# EasyEDA Pro project EasyEDA_Pro_EXPORT.epro

# Schematic testing_stage1_schematic

## Sheets
1 microcontroller: Board Name: testing_stage1; Create Date: 2025-03-28; Page Name: microcontroller; Project Name: macropad-final; Schematic Name: testing_stage1_schematic; Update Date: 2025-03-29; Company: EasyEDA.com; Page Size: A4; Version: V1.0
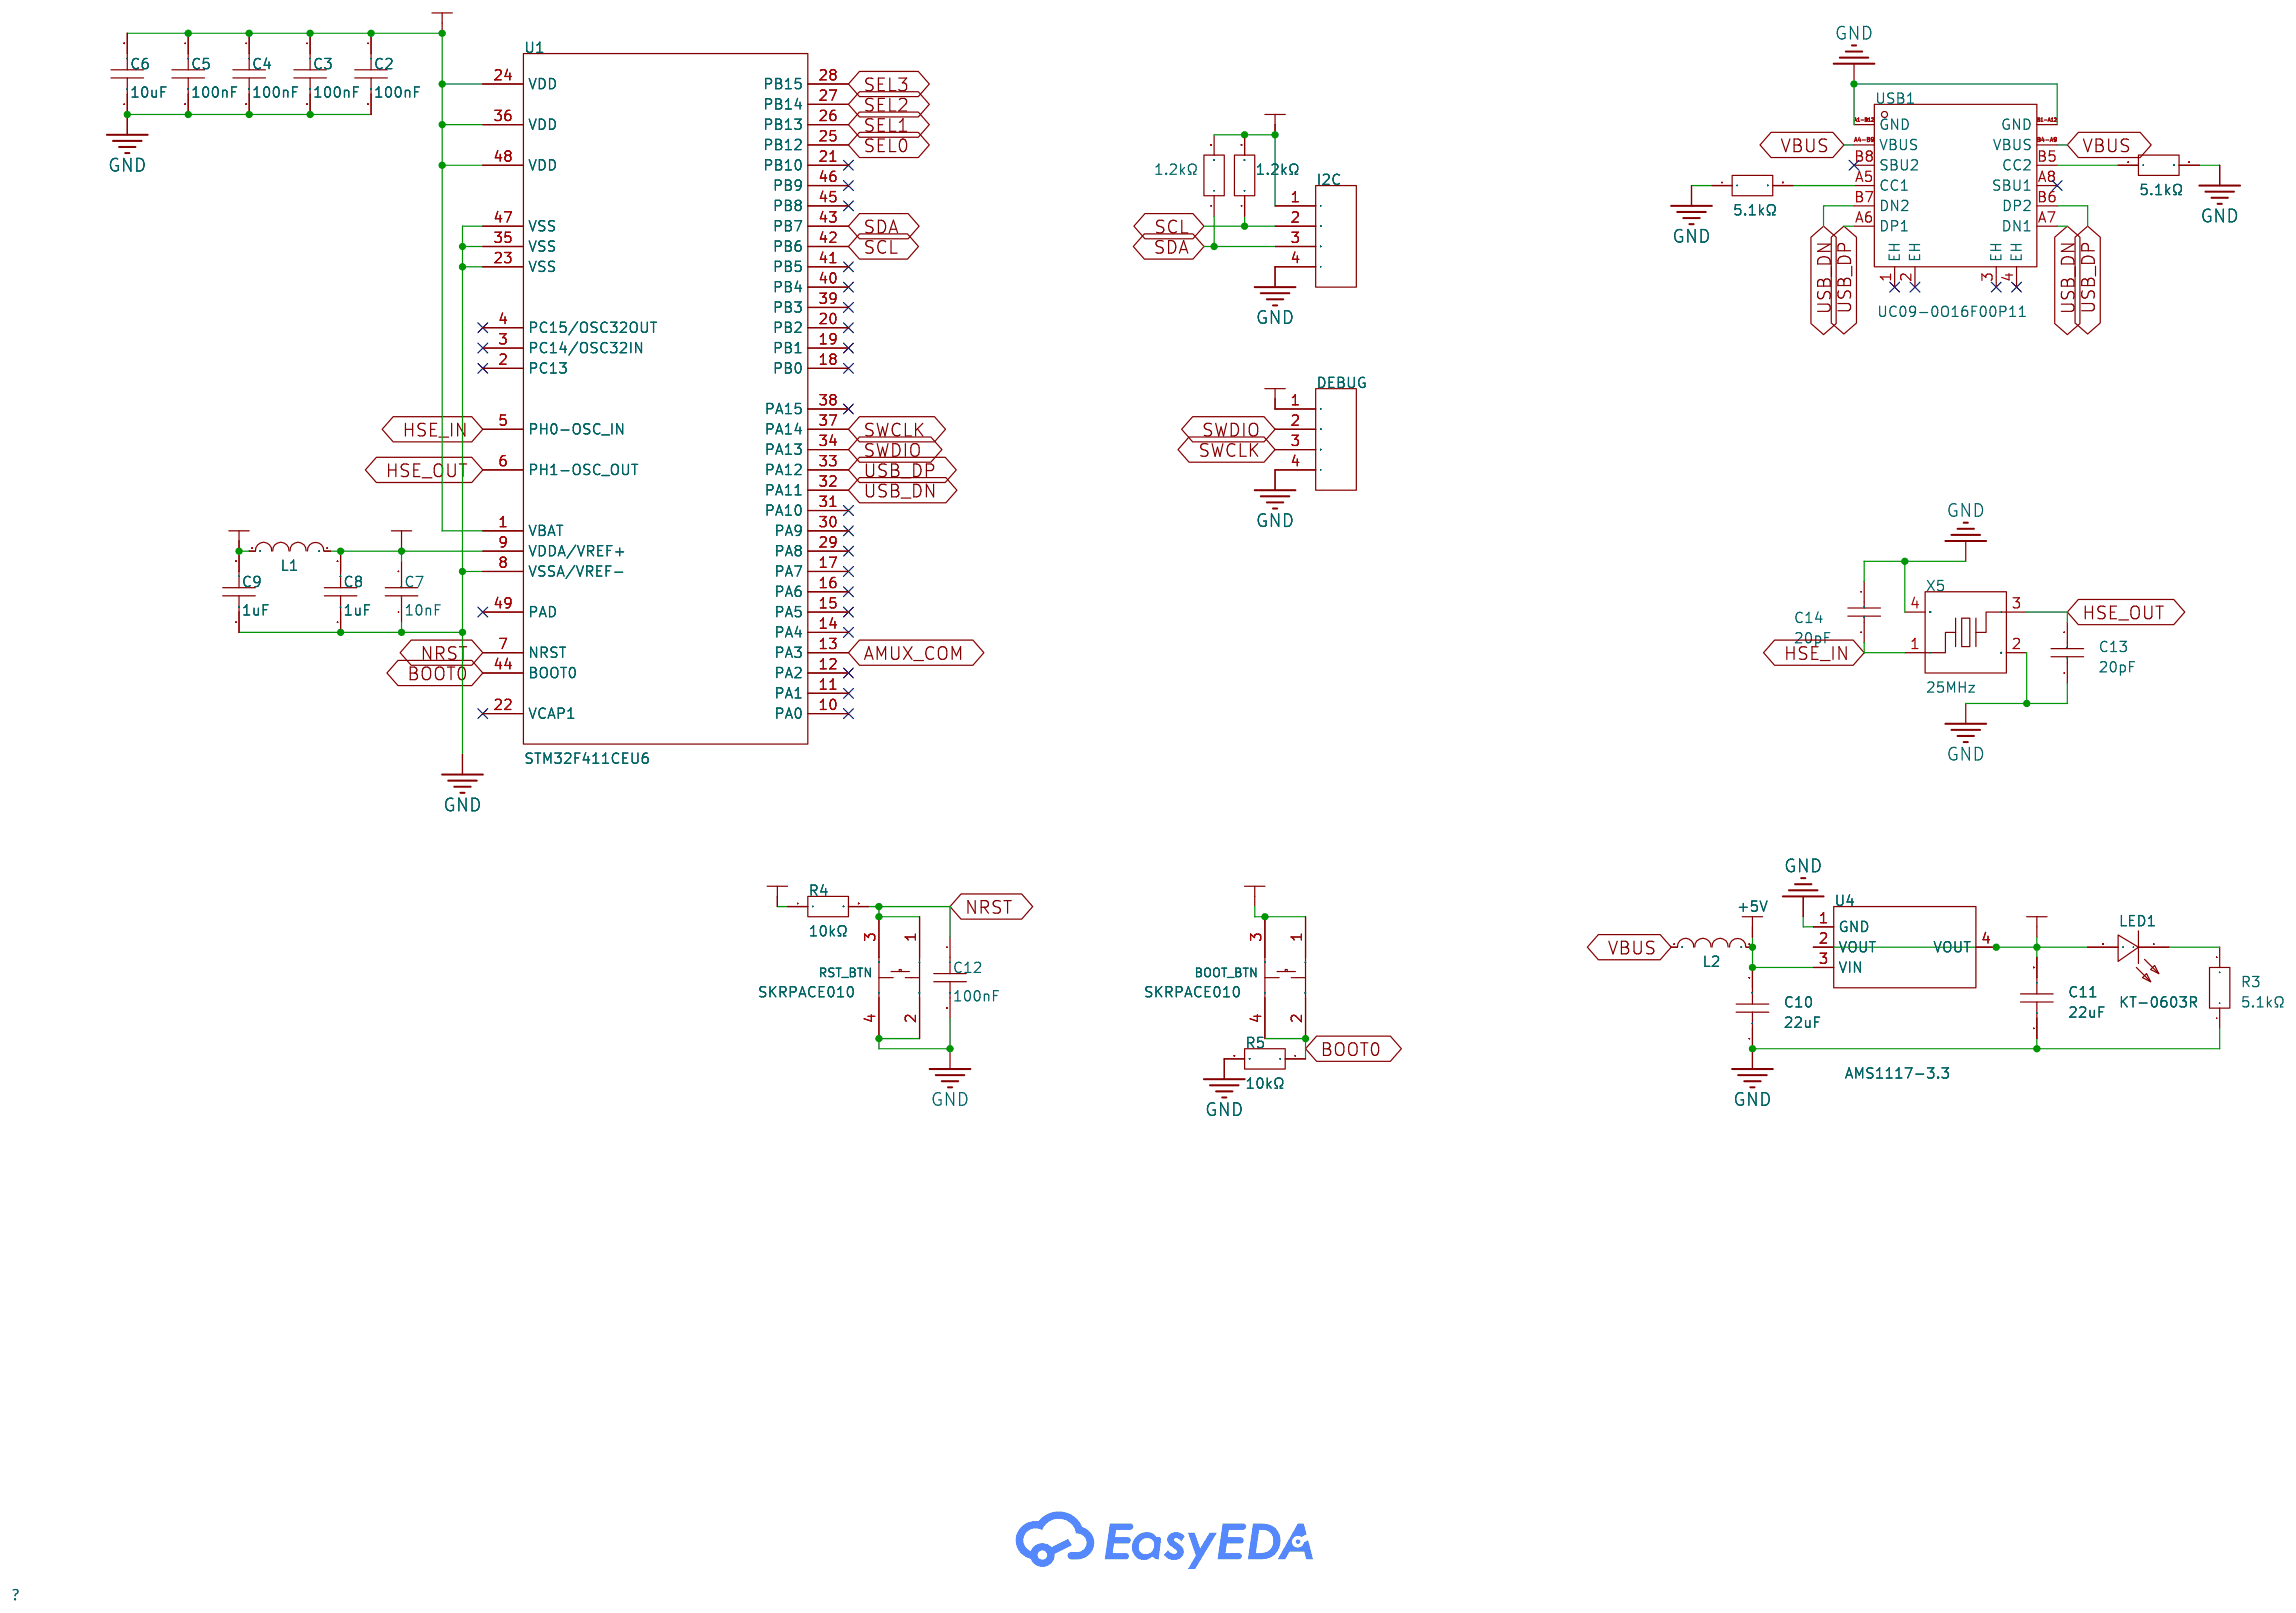
[diagram p0: microcontroller]
2 buttons: Page Name: buttons
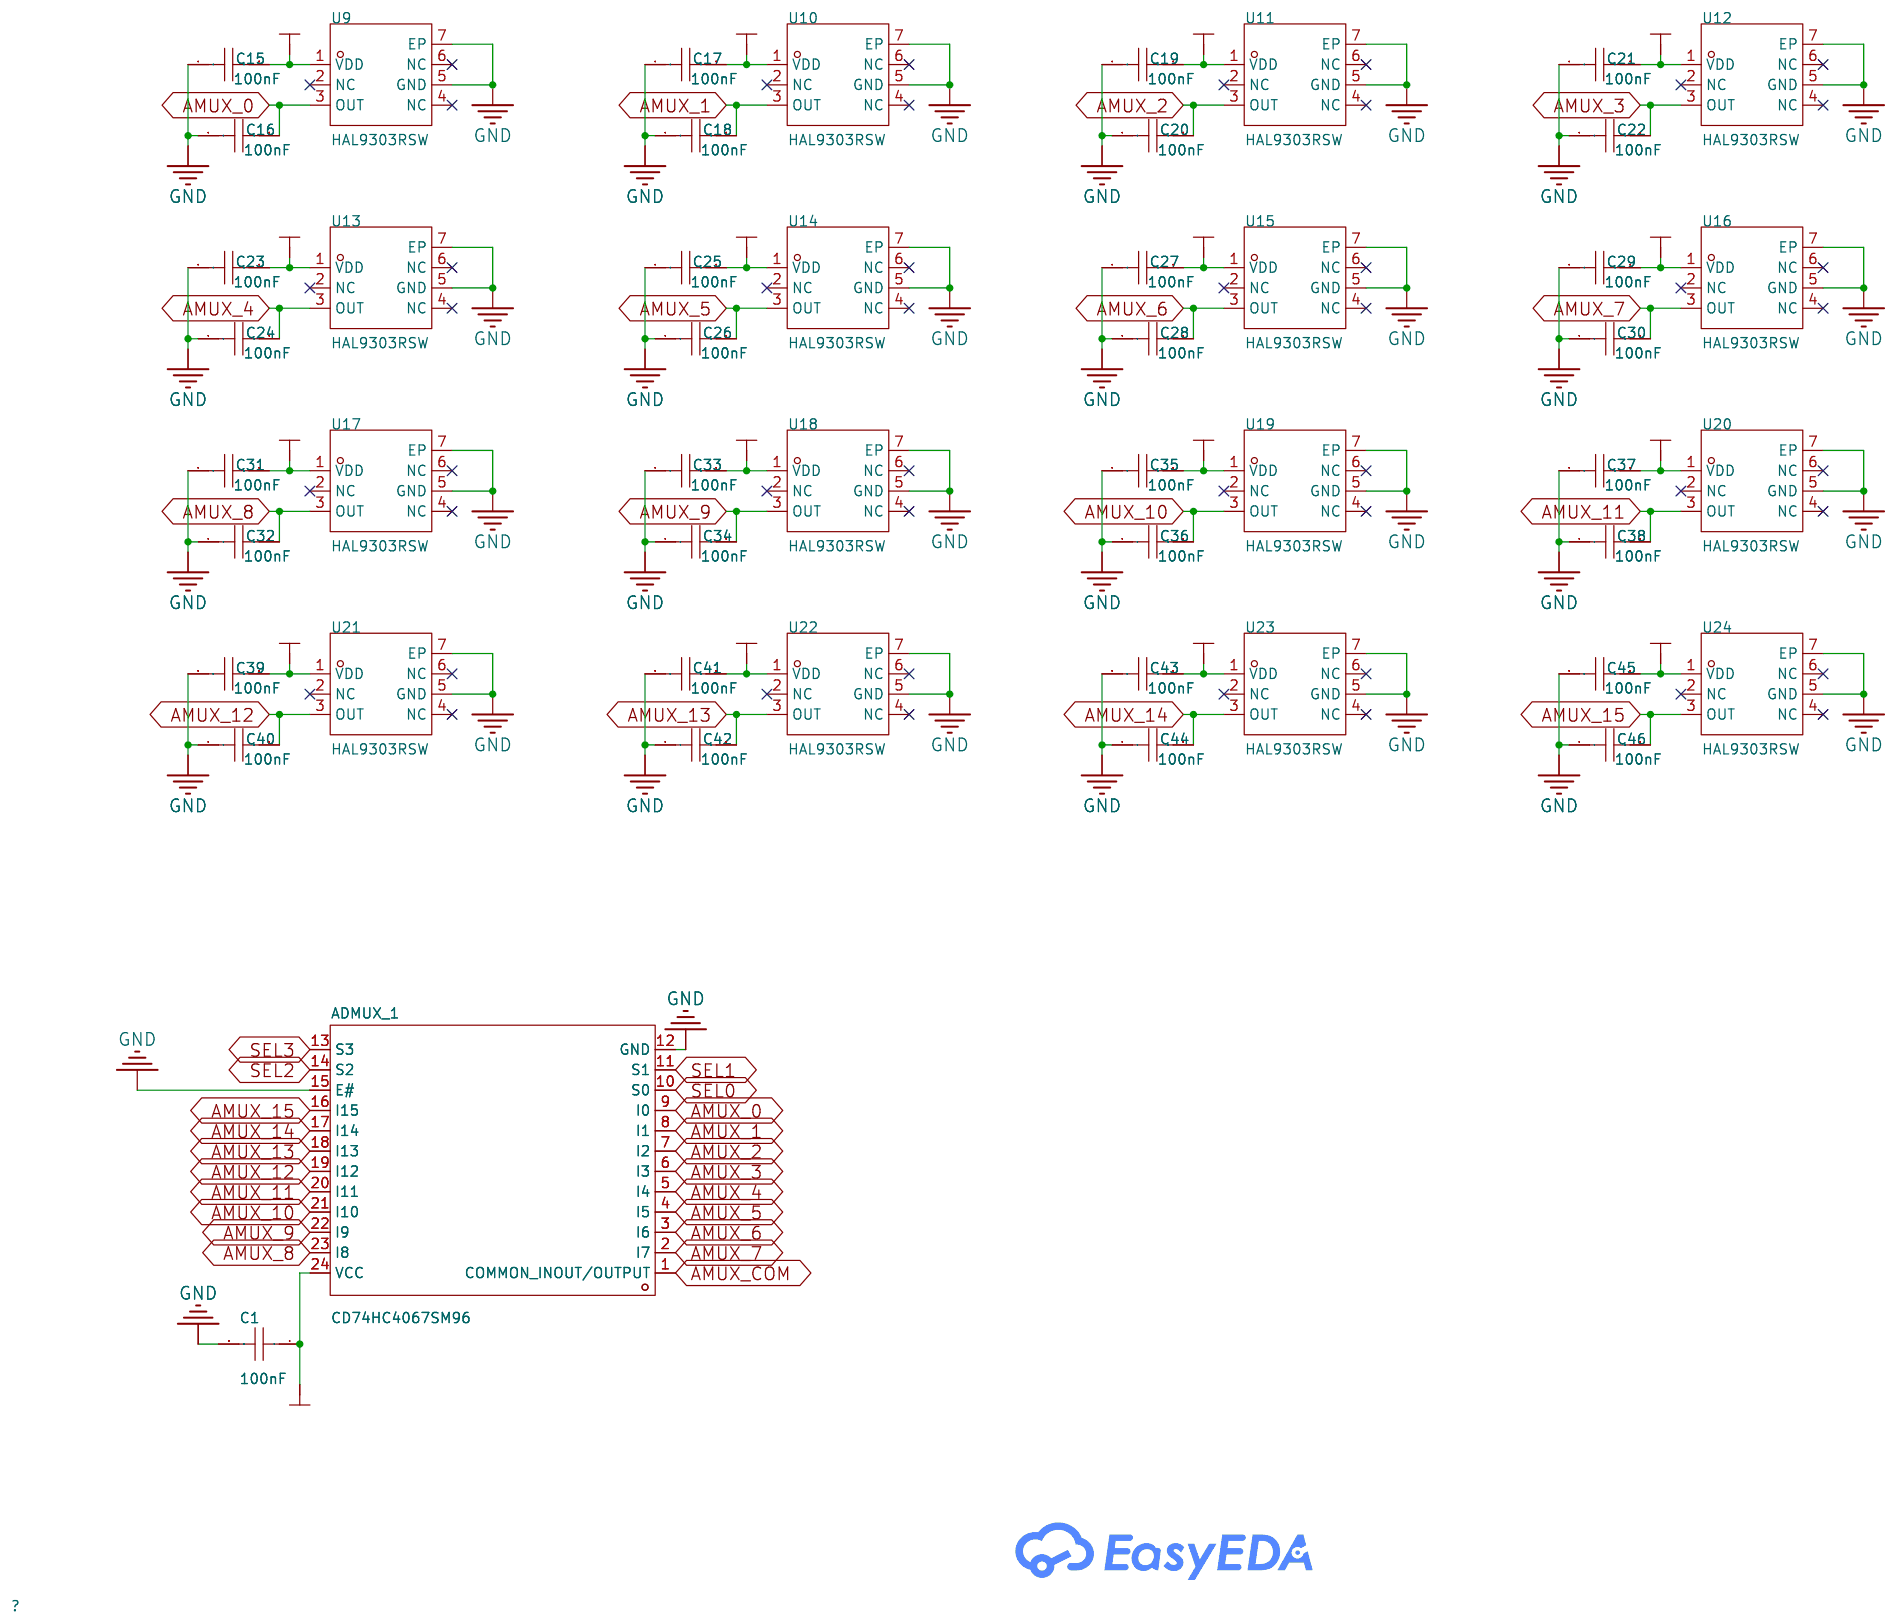
[diagram p1: buttons]

## Parts
sheet buttons
ADMUX_1  CD74HC4067SM96  [SSOP-24_L8.1-W5.3-P0.65-LS7.8-BL]
C1  100nF  [C0201]
C15  100nF  [C0201]
C16  100nF  [C0201]
C17  100nF  [C0201]
C18  100nF  [C0201]
C19  100nF  [C0201]
C20  100nF  [C0201]
C21  100nF  [C0201]
C22  100nF  [C0201]
C23  100nF  [C0201]
C24  100nF  [C0201]
C25  100nF  [C0201]
C26  100nF  [C0201]
C27  100nF  [C0201]
C28  100nF  [C0201]
C29  100nF  [C0201]
C30  100nF  [C0201]
C31  100nF  [C0201]
C32  100nF  [C0201]
C33  100nF  [C0201]
C34  100nF  [C0201]
C35  100nF  [C0201]
C36  100nF  [C0201]
C37  100nF  [C0201]
C38  100nF  [C0201]
C39  100nF  [C0201]
C40  100nF  [C0201]
C41  100nF  [C0201]
C42  100nF  [C0201]
C43  100nF  [C0201]
C44  100nF  [C0201]
C45  100nF  [C0201]
C46  100nF  [C0201]
U9  HAL9303RSW  [DFN1616-6_L1.6-W1.6-P0.50-BL-EP_RICOH_RP500X]
U10  HAL9303RSW  [DFN1616-6_L1.6-W1.6-P0.50-BL-EP_RICOH_RP500X]
U11  HAL9303RSW  [DFN1616-6_L1.6-W1.6-P0.50-BL-EP_RICOH_RP500X]
U12  HAL9303RSW  [DFN1616-6_L1.6-W1.6-P0.50-BL-EP_RICOH_RP500X]
U13  HAL9303RSW  [DFN1616-6_L1.6-W1.6-P0.50-BL-EP_RICOH_RP500X]
U14  HAL9303RSW  [DFN1616-6_L1.6-W1.6-P0.50-BL-EP_RICOH_RP500X]
U15  HAL9303RSW  [DFN1616-6_L1.6-W1.6-P0.50-BL-EP_RICOH_RP500X]
U16  HAL9303RSW  [DFN1616-6_L1.6-W1.6-P0.50-BL-EP_RICOH_RP500X]
U17  HAL9303RSW  [DFN1616-6_L1.6-W1.6-P0.50-BL-EP_RICOH_RP500X]
U18  HAL9303RSW  [DFN1616-6_L1.6-W1.6-P0.50-BL-EP_RICOH_RP500X]
U19  HAL9303RSW  [DFN1616-6_L1.6-W1.6-P0.50-BL-EP_RICOH_RP500X]
U20  HAL9303RSW  [DFN1616-6_L1.6-W1.6-P0.50-BL-EP_RICOH_RP500X]
U21  HAL9303RSW  [DFN1616-6_L1.6-W1.6-P0.50-BL-EP_RICOH_RP500X]
U22  HAL9303RSW  [DFN1616-6_L1.6-W1.6-P0.50-BL-EP_RICOH_RP500X]
U23  HAL9303RSW  [DFN1616-6_L1.6-W1.6-P0.50-BL-EP_RICOH_RP500X]
U24  HAL9303RSW  [DFN1616-6_L1.6-W1.6-P0.50-BL-EP_RICOH_RP500X]
sheet microcontroller
BOOT_BTN  SKRPACE010  [KEY-SMD_4P-L4.2-W3.2-P2.20-LS4.6]
C2  100nF  [C0201]
C3  100nF  [C0201]
C4  100nF  [C0201]
C5  100nF  [C0201]
C6  10uF  [C1206]
C7  10nF  [C0402]
C8  1uF  [C0402]
C9  1uF  [C0402]
C10  22uF  [C1206]
C11  22uF  [C1206]
C12  100nF  [C0201]
C13  20pF  [C0402]
C14  20pF  [C0402]
DEBUG  -  [4 Pin Header]  (no BOM)
I2C  -  [4 Pin Header]  (no BOM)
L1  BLM18AG121SN1D  [L0603]
L2  BLM18AG121SN1D  [L0603]
LED1  KT-0603R  [LED0603-RD]
R1  5.1kΩ  [R0402]
R2  5.1kΩ  [R0402]
R3  5.1kΩ  [R0402]
R4  10kΩ  [R0805]
R5  10kΩ  [R0805]
R6  1.2kΩ  [R0201]
R7  1.2kΩ  [R0201]
RST_BTN  SKRPACE010  [KEY-SMD_4P-L4.2-W3.2-P2.20-LS4.6]
U1  STM32F411CEU6  [UFQFPN-48_L7.0-W7.0-P0.50-BL-EP]
U4  AMS1117-3.3  [SOT-223-3_L6.5-W3.4-P2.30-LS7.0-BR]
USB1  UC09-0O16F00P11  [USB-C-SMD_UC09-0O16F00P11]
X5  25MHz  [CRYSTAL-SMD_4P-L3.2-W2.5-BL]

## Library data of the parts
ADMUX_1 = CD74HC4067SM96: Switch Circuit:- Number of Channels:16 Supply Voltage:2V~6V Supply Voltage:2V~6V Turn-on time:90ns On-State Resistance (Max):240Ω Turn-off time:87ns Operating Temperature:-55℃~+125℃ Operating Temperature:-55℃~+125℃; LCSC Part Name: 高速CMOS逻辑16通道模拟多路复用器/解复用器; Supplier Part: C98457; Manufacturer: TI(德州仪器); Supplier Footprint: SSOP-24-208mil; JLCPCB Part Class: Extended Part; Datasheet: https://www.ti.com/cn/lit/gpn/cd74hc4067; Supplier: LCSC; Number of Channels: 16; Supply Voltage: 2V~6V; Turn-on time: 90ns; On-State Resistance (Max): 240Ω; Turn-off time: 87ns; Operating Temperature: -55℃~+125℃
C1-C5 C12 C15-C46 = TCC0201X7R104K160ZT: Capacitance:100nF Tolerance:±10% Tolerance:±10% Voltage Rating:16V Temperature Coefficient:X7R; LCSC Part Name: 100nF ±10% 16V; Supplier Part: C18164586; Manufacturer: CCTC(三环); Supplier Footprint: 0201; JLCPCB Part Class: Extended Part; Datasheet: https://atta.szlcsc.com/upload/public/pdf/source/20191203/C466239_F62A586702D44EEA1C39B32FC8662B21.pdf; Supplier: LCSC; Tolerance: ±10%; Voltage Rating: 16V; Temperature Coefficient: X7R
U9-U24 = HAL9303RSW: Type:- supply voltage:- supply voltage:-; Supplier Part: C42387472; Manufacturer: Hallwee(霍尔微电子); Supplier Footprint: DFN-6-EP(1.6x1.6); Datasheet: https://atta.szlcsc.com/upload/public/pdf/source/20241128/4D6AE4F8742D3C17AD5884A18EBEC5A8.pdf; Supplier: LCSC
BOOT_BTN RST_BTN = SKRPACE010: Circuit:SPST Actuator Style:Oval button Mounting Style:Brick nogging Switch Length:4.2mm Switch Width:3.2mm Switch Height:2.5mm Contact Current:50mA Voltage Rating (DC):16V With Lamp:- Mechanical Life:-; LCSC Part Name: 4.2*3.2*2.5mm 立贴 轻触开关; Supplier Part: C139797; Manufacturer: ALPSALPINE(阿尔卑斯阿尔派); Supplier Footprint: SMD; JLCPCB Part Class: Extended Part; Datasheet: https://atta.szlcsc.com/upload/public/pdf/source/20171113/C139797_15105612676371115729.pdf; Supplier: LCSC; Circuit: SPST; Actuator Style: Oval button; Mounting Style: Brick nogging; Switch Length: 4.2mm; Switch Width: 3.2mm; Switch Height: 2.5mm; Contact Current: 50mA; Voltage Rating (DC): 16V
C6 = HGC1206R7106K350NSPJ: Capacitance:10uF Tolerance:±10% Tolerance:±10% Voltage Rating:35V Temperature Coefficient:X7R; LCSC Part Name: 10uF ±10% 35V; Supplier Part: C33546014; Manufacturer: Chinocera(华瓷); Supplier Footprint: 1206; JLCPCB Part Class: Extended Part; Datasheet: https://atta.szlcsc.com/upload/public/pdf/source/20240724/7749F3690BCC21BF5565A9D339ADF00C.pdf; Supplier: LCSC; Tolerance: ±10%; Voltage Rating: 35V; Temperature Coefficient: X7R
C7 = 0402B103K500NT: Capacitance:10nF Tolerance:±10% Tolerance:±10% Voltage Rating:50V Temperature Coefficient:X7R; LCSC Part Name: 10nF ±10% 50V; Supplier Part: C1524; Manufacturer: FH(风华); Supplier Footprint: 0402; JLCPCB Part Class: Extended Part; Datasheet: https://atta.szlcsc.com/upload/public/pdf/source/20200305/C486355_26A10D38EF8C2A5C37091D0039909270.pdf; Supplier: LCSC; Tolerance: ±10%; Voltage Rating: 50V; Temperature Coefficient: X7R
C8 C9 = TCC0402X5R105K500AT: Capacitance:1uF Tolerance:±10% Tolerance:±10% Voltage Rating:50V Temperature Coefficient:X5R; LCSC Part Name: 1uF ±10% 50V; Supplier Part: C20539426; Manufacturer: CCTC(三环); Supplier Footprint: 0402; JLCPCB Part Class: Extended Part; Datasheet: https://atta.szlcsc.com/upload/public/pdf/source/20191203/C466239_F62A586702D44EEA1C39B32FC8662B21.pdf; Supplier: LCSC; Tolerance: ±10%; Voltage Rating: 50V; Temperature Coefficient: X5R
C10 C11 = TCC1206X7R226K160HT: Capacitance:22uF Tolerance:±10% Tolerance:±10% Voltage Rating:16V Temperature Coefficient:X7R; LCSC Part Name: 22uF ±10% 16V; Supplier Part: C22392398; Manufacturer: CCTC(三环); Supplier Footprint: 1206; JLCPCB Part Class: Extended Part; Datasheet: https://atta.szlcsc.com/upload/public/pdf/source/20191203/C466239_F62A586702D44EEA1C39B32FC8662B21.pdf; Supplier: LCSC; Tolerance: ±10%; Voltage Rating: 16V; Temperature Coefficient: X7R
C13 C14 = 0402CG200J500NT: Capacitance: Tolerance:±5% Tolerance:±5% Voltage Rated: Temperature Coefficient:; LCSC Part Name: 20pF ±5% 50V; Supplier Part: C1554; Manufacturer: FH(风华); Supplier Footprint: 0402; JLCPCB Part Class: Basic Part; Datasheet: https://atta.szlcsc.com/upload/public/pdf/source/20200305/C486355_26A10D38EF8C2A5C37091D0039909270.pdf; Supplier: LCSC; Tolerance: ±5%
DEBUG I2C = 4 Pin Header
L1 L2 = BLM18AG121SN1D: Impedance @ Frequency:120Ω@100MHz Tolerance:±25% Tolerance:±25% DC Resistance:180mΩ Current Rating:800mA Circuits:1; LCSC Part Name: 单路 0603磁珠 阻抗120Ω@100MHz; Supplier Part: C76892; Manufacturer: muRata(村田); Supplier Footprint: 0603; JLCPCB Part Class: Extended Part; Datasheet: https://atta.szlcsc.com/upload/public/pdf/source/20180329/C160981_FD3C2D2622A377E203B89F4AA32B0741.pdf; Supplier: LCSC; Impedance @ Frequency: 120Ω@100MHz; Tolerance: ±25%; DC Resistance: 180mΩ; Current Rating: 800mA; Circuits: 1
LED1 = KT-0603R: Emitted Color:Red Power Dissipation:- Forward Current:- Dominant Wavelength:- Dominant Wavelength:- Peak Wavelength:- Diode Configuration:- Lens Color:- Color Temperature:- Color Temperature:- Viewing Angle:- Mounting Sytle:- Operating Temperature:-40℃~+8; LCSC Part Name: 0603 红灯 高亮; Supplier Part: C2286; Manufacturer: KENTO; Supplier Footprint: 0603; JLCPCB Part Class: Basic Part; Datasheet: https://atta.szlcsc.com/upload/public/pdf/source/20160616/1466072038404.pdf; Supplier: LCSC; Emitted Color: Red; Operating Temperature: -40℃~+85℃
R1-R3 = FRC0402J512 TS: Type:Thick Film Resistors Resistance:5.1kΩ Tolerance:±5% Tolerance:±5% Power(Watts):1/16W Voltage-Supply(Max):50V Temperature Coefficient:±100ppm/℃ Temperature Coefficient:±100ppm/℃ Operating Temperature:-55℃~+155℃ Operating Temperature:-55℃~+155℃; LCSC Part Name: 5.1kΩ ±5% 62.5mW 厚膜电阻; Supplier Part: C2906948; Manufacturer: FOJAN(富捷); Supplier Footprint: 0402; JLCPCB Part Class: Extended Part; Datasheet: https://atta.szlcsc.com/upload/public/pdf/source/20211221/925EC7D7225764EE0046F22065062C87.pdf; Supplier: LCSC; Type: Thick Film Resistors; Tolerance: ±5%; Power(Watts): 1/16W; Voltage-Supply(Max): 50V; Temperature Coefficient: ±100ppm/℃; Operating Temperature: -55℃~+155℃
R4 R5 = HoAR0805-1/8W-10KR-1%-TCR25: Type:Ceramic resistor Resistance:10kΩ Tolerance:±1% Tolerance:±1% Power(Watts):1/8W Temperature Coefficient:±25ppm/℃ Temperature Coefficient:±25ppm/℃; LCSC Part Name: 陶瓷电阻 10kΩ ±1% 125mW; Supplier Part: C5123591; Manufacturer: Milliohm(毫欧); Supplier Footprint: 0805; JLCPCB Part Class: Extended Part; Datasheet: https://atta.szlcsc.com/upload/public/pdf/source/20220805/6A845D963435C707E89C4EB374FF6A6C.pdf; Supplier: LCSC; Type: Ceramic resistor; Tolerance: ±1%; Power(Watts): 1/8W; Temperature Coefficient: ±25ppm/℃
R6 R7 = AC0201FR-071K2L: Type:Thick Film Resistors Resistance:1.2kΩ Tolerance:±1% Tolerance:±1% Power(Watts):50mW Voltage-Supply(Max):25V Temperature Coefficient:±200ppm/℃ Temperature Coefficient:±200ppm/℃ Operating Temperature:-55℃~+155℃ Operating Temperature:-55℃~+155℃; LCSC Part Name: 厚膜电阻 1.2kΩ ±1% 50mW; Supplier Part: C226448; Manufacturer: YAGEO(国巨); Supplier Footprint: 0201; JLCPCB Part Class: Extended Part; Datasheet: https://atta.szlcsc.com/upload/public/pdf/source/20211117/A6A0BDAE103E877571F8FBA448670DE2.pdf; Supplier: LCSC; Type: Thick Film Resistors; Tolerance: ±1%; Power(Watts): 50mW; Voltage-Supply(Max): 25V; Temperature Coefficient: ±200ppm/℃; Operating Temperature: -55℃~+155℃
U1 = STM32F411CEU6: CPU Core:ARM-M4 CPU Maximum Speed:100MHz Program Storage Size:512KB Program Memory Type:FLASH Number of I/O:36 ADC (Bit):12bit Low Voltage Detection Threshold:1.7V~3.6V Low Voltage Detection Threshold:1.7V~3.6V Application Area:-; LCSC Part Name: 带DSP和FPU的高性能基本型系列ARM Cortex-M4 MCU，具有512 KB Flash、100 MHz CPU和ART加速器; Supplier Part: C60420; Manufacturer: ST(意法半导体); Supplier Footprint: UFQFPN-48(7x7); JLCPCB Part Class: Extended Part; Datasheet: https://atta.szlcsc.com/upload/public/pdf/source/20151026/1457707507170.pdf; Supplier: LCSC; CPU Core: ARM-M4; CPU Maximum Speed: 100MHz; Program Storage Size: 512KB; Program Memory Type: FLASH; Number of I/O: 36; ADC (Bit): 12bit; Low Voltage Detection Threshold: 1.7V~3.6V
U4 = AMS1117-3.3_C6186: Output Type:Fixed Voltage - Supply:- Output Voltage:3.3V Output Voltage:3.3V Output Current:1A Power Supply Rejection Ratio (PSRR):72dB@(120Hz) Voltage Dropout:1.3V@(800mA) standby current:- Noise:- Features:Overcurrent Protection(OCP)；热关断(TSD) Operating; LCSC Part Name: 输出3.3V 1A; Supplier Part: C6186; Manufacturer: AMS; Supplier Footprint: SOT-223; JLCPCB Part Class: Basic Part; Datasheet: https://atta.szlcsc.com/upload/public/pdf/source/20180727/C6186_7A095716F0823C02F1997A905E26C086.pdf; Supplier: LCSC; Output Type: Fixed; Output Voltage: 3.3V; Output Current: 1A; Power Supply Rejection Ratio (PSRR): 72dB@(120Hz); Voltage Dropout: 1.3V@(800mA); Features: Overcurrent Protection(OCP)；热关断(TSD); Output Configuration: Positive electrode; Number of Outputs: 1
USB1 = UC09-0O16F00P11: Connector Type:Type-C Gender:Female Mounting Type:Horizontal attachment Number of Contacts:16P Number of Ports:1 Current Rating-Power:3A; LCSC Part Name: USB Type-C 母座 卧贴; Supplier Part: C36936541; Manufacturer: BXCONN(宝讯); Supplier Footprint: SMD; JLCPCB Part Class: Extended Part; Datasheet: https://atta.szlcsc.com/upload/public/pdf/source/20240731/591155F6664C57552DC307035301A7C8.pdf; Supplier: LCSC; Connector Type: Type-C; Gender: Female; Mounting Type: Horizontal attachment; Number of Contacts: 16P; Number of Ports: 1; Current Rating-Power: 3A
X5 = S3225000271060C3: Type:Surface Mount Crystal Frequency:25MHz Normal temperature Frequency Tolerance:±10ppm Normal temperature Frequency Tolerance:±10ppm Load Capacitance:27pF Frequency Stability:±30ppm Frequency Stability:±30ppm Equivalent Series Resistance(ESR):60Ω Operat; LCSC Part Name: 25MHz ±10ppm 27pF; Supplier Part: C5380610; Manufacturer: JGHC(晶光华); Supplier Footprint: SMD3225-4P; JLCPCB Part Class: Extended Part; Datasheet: https://atta.szlcsc.com/upload/public/pdf/source/20241029/60EE57D51513354C612A10EC3AE04C53.pdf; Supplier: LCSC; Type: Surface Mount Crystal; Normal temperature Frequency Tolerance: ±10ppm; Load Capacitance: 27pF; Frequency Stability: ±30ppm; Equivalent Series Resistance(ESR): 60Ω; Operating Temperature: -40℃~+85℃

## Nets
+3.3V: ADMUX_1.24(VCC) BOOT_BTN.1 BOOT_BTN.3 C1.1 C2.1 C3.1 C4.1 C5.1 C6.2 C9.2 C11.2 C15.2 C17.2 C19.2 C21.2 C23.2 C25.2 C27.2 C29.2 C31.2 C33.2 C35.2 C37.2 C39.2 C41.2 C43.2 C45.2 DEBUG.1 I2C.1 L1.1 LED1.2(A) R4.1 R6.2 R7.2 U1.1(VBAT) U1.24(VDD) U1.36(VDD) U1.48(VDD) U4.2(VOUT) U4.4(VOUT) U9.1(VDD) U10.1(VDD) U11.1(VDD) U12.1(VDD) U13.1(VDD) U14.1(VDD) U15.1(VDD) U16.1(VDD) U17.1(VDD) U18.1(VDD) U19.1(VDD) U20.1(VDD) U21.1(VDD) U22.1(VDD) U23.1(VDD) U24.1(VDD)
+3.3VA: C7.2 C8.2 L1.2 U1.9(VDDA/VREF+)
+5V: C10.2 L2.2 U4.3(VIN)
GND: ADMUX_1.12(GND) ADMUX_1.15(E#) C1.2 C2.2 C3.2 C4.2 C5.2 C6.1 C7.1 C8.1 C9.1 C10.1 C11.1 C12.2 C13.1 C14.1 C15.1 C16.1 C17.1 C18.1 C19.1 C20.1 C21.1 C22.1 C23.1 C24.1 C25.1 C26.1 C27.1 C28.1 C29.1 C30.1 C31.1 C32.1 C33.1 C34.1 C35.1 C36.1 C37.1 C38.1 C39.1 C40.1 C41.1 C42.1 C43.1 C44.1 C45.1 C46.1 DEBUG.4 I2C.4 R1.1 R2.2 R3.1 R5.2 RST_BTN.2 RST_BTN.4 U1.8(VSSA/VREF-) U1.23(VSS) U1.35(VSS) U1.47(VSS) U4.1(GND) U9.5(GND) U9.7(EP) U10.5(GND) U10.7(EP) U11.5(GND) U11.7(EP) U12.5(GND) U12.7(EP) U13.5(GND) U13.7(EP) U14.5(GND) U14.7(EP) U15.5(GND) U15.7(EP) U16.5(GND) U16.7(EP) U17.5(GND) U17.7(EP) U18.5(GND) U18.7(EP) U19.5(GND) U19.7(EP) U20.5(GND) U20.7(EP) U21.5(GND) U21.7(EP) U22.5(GND) U22.7(EP) U23.5(GND) U23.7(EP) U24.5(GND) U24.7(EP) USB1.A1-B12(GND) USB1.B1-A12(GND) X5.2(GND) X5.4(GND)
VBUS: L2.1 USB1.A4-B9(VBUS) USB1.B4-A9(VBUS)
AMUX_0: ADMUX_1.9(I0) C16.2 U9.3(OUT)
AMUX_1: ADMUX_1.8(I1) C18.2 U10.3(OUT)
AMUX_2: ADMUX_1.7(I2) C20.2 U11.3(OUT)
AMUX_3: ADMUX_1.6(I3) C22.2 U12.3(OUT)
AMUX_4: ADMUX_1.5(I4) C24.2 U13.3(OUT)
AMUX_5: ADMUX_1.4(I5) C26.2 U14.3(OUT)
AMUX_6: ADMUX_1.3(I6) C28.2 U15.3(OUT)
AMUX_7: ADMUX_1.2(I7) C30.2 U16.3(OUT)
AMUX_8: ADMUX_1.23(I8) C32.2 U17.3(OUT)
AMUX_9: ADMUX_1.22(I9) C34.2 U18.3(OUT)
AMUX_10: ADMUX_1.21(I10) C36.2 U19.3(OUT)
AMUX_11: ADMUX_1.20(I11) C38.2 U20.3(OUT)
AMUX_12: ADMUX_1.19(I12) C40.2 U21.3(OUT)
AMUX_13: ADMUX_1.18(I13) C42.2 U22.3(OUT)
AMUX_14: ADMUX_1.17(I14) C44.2 U23.3(OUT)
AMUX_15: ADMUX_1.16(I15) C46.2 U24.3(OUT)
AMUX_COM: ADMUX_1.1(COMMON INOUT/OUTPUT) U1.13(PA3)
BOOT0: BOOT_BTN.2 BOOT_BTN.4 R5.1 U1.44(BOOT0)
HSE_IN: C14.2 U1.5(PH0-OSC_IN) X5.1
HSE_OUT: C13.2 U1.6(PH1-OSC_OUT) X5.3
NRST: C12.1 R4.2 RST_BTN.1 RST_BTN.3 U1.7(NRST)
SCL: I2C.2 R6.1 U1.42(PB6)
SDA: I2C.3 R7.1 U1.43(PB7)
SEL0: ADMUX_1.10(S0) U1.25(PB12)
SEL1: ADMUX_1.11(S1) U1.26(PB13)
SEL2: ADMUX_1.14(S2) U1.27(PB14)
SEL3: ADMUX_1.13(S3) U1.28(PB15)
SWCLK: DEBUG.3 U1.37(PA14)
SWDIO: DEBUG.2 U1.34(PA13)
USB_DN: U1.32(PA11) USB1.A7(DN1) USB1.B7(DN2)
USB_DP: U1.33(PA12) USB1.A6(DP1) USB1.B6(DP2)
$1N3487: R1.2 USB1.A5(CC1)
$1N3526: R2.1 USB1.B5(CC2)
$1N4144: LED1.1(K) R3.2

Not connected (* = marked no-connect by the designer): U1 2(PC13)* 3(PC14/OSC32IN)* 4(PC15/OSC32OUT)* 10(PA0)* 11(PA1)* 12(PA2)* 14(PA4)* 15(PA5)* 16(PA6)* 17(PA7)* 18(PB0)* 19(PB1)* 20(PB2)* 21(PB10)* 22(VCAP1)* 29(PA8)* 30(PA9)* 31(PA10)* 38(PA15)* 39(PB3)* 40(PB4)* 41(PB5)* 45(PB8)* 46(PB9)* 49(PAD)*; U9 2(NC)* 4(NC)* 6(NC)*; U10 2(NC)* 4(NC)* 6(NC)*; U11 2(NC)* 4(NC)* 6(NC)*; U12 2(NC)* 4(NC)* 6(NC)*; U13 2(NC)* 4(NC)* 6(NC)*; U14 2(NC)* 4(NC)* 6(NC)*; U15 2(NC)* 4(NC)* 6(NC)*; U16 2(NC)* 4(NC)* 6(NC)*; U17 2(NC)* 4(NC)* 6(NC)*; U18 2(NC)* 4(NC)* 6(NC)*; U19 2(NC)* 4(NC)* 6(NC)*; U20 2(NC)* 4(NC)* 6(NC)*; U21 2(NC)* 4(NC)* 6(NC)*; U22 2(NC)* 4(NC)* 6(NC)*; U23 2(NC)* 4(NC)* 6(NC)*; U24 2(NC)* 4(NC)* 6(NC)*; USB1 1(EH)* 2(EH)* 3(EH)* 4(EH)* A8(SBU1)* B8(SBU2)*

# Board testing_stage1_pcb
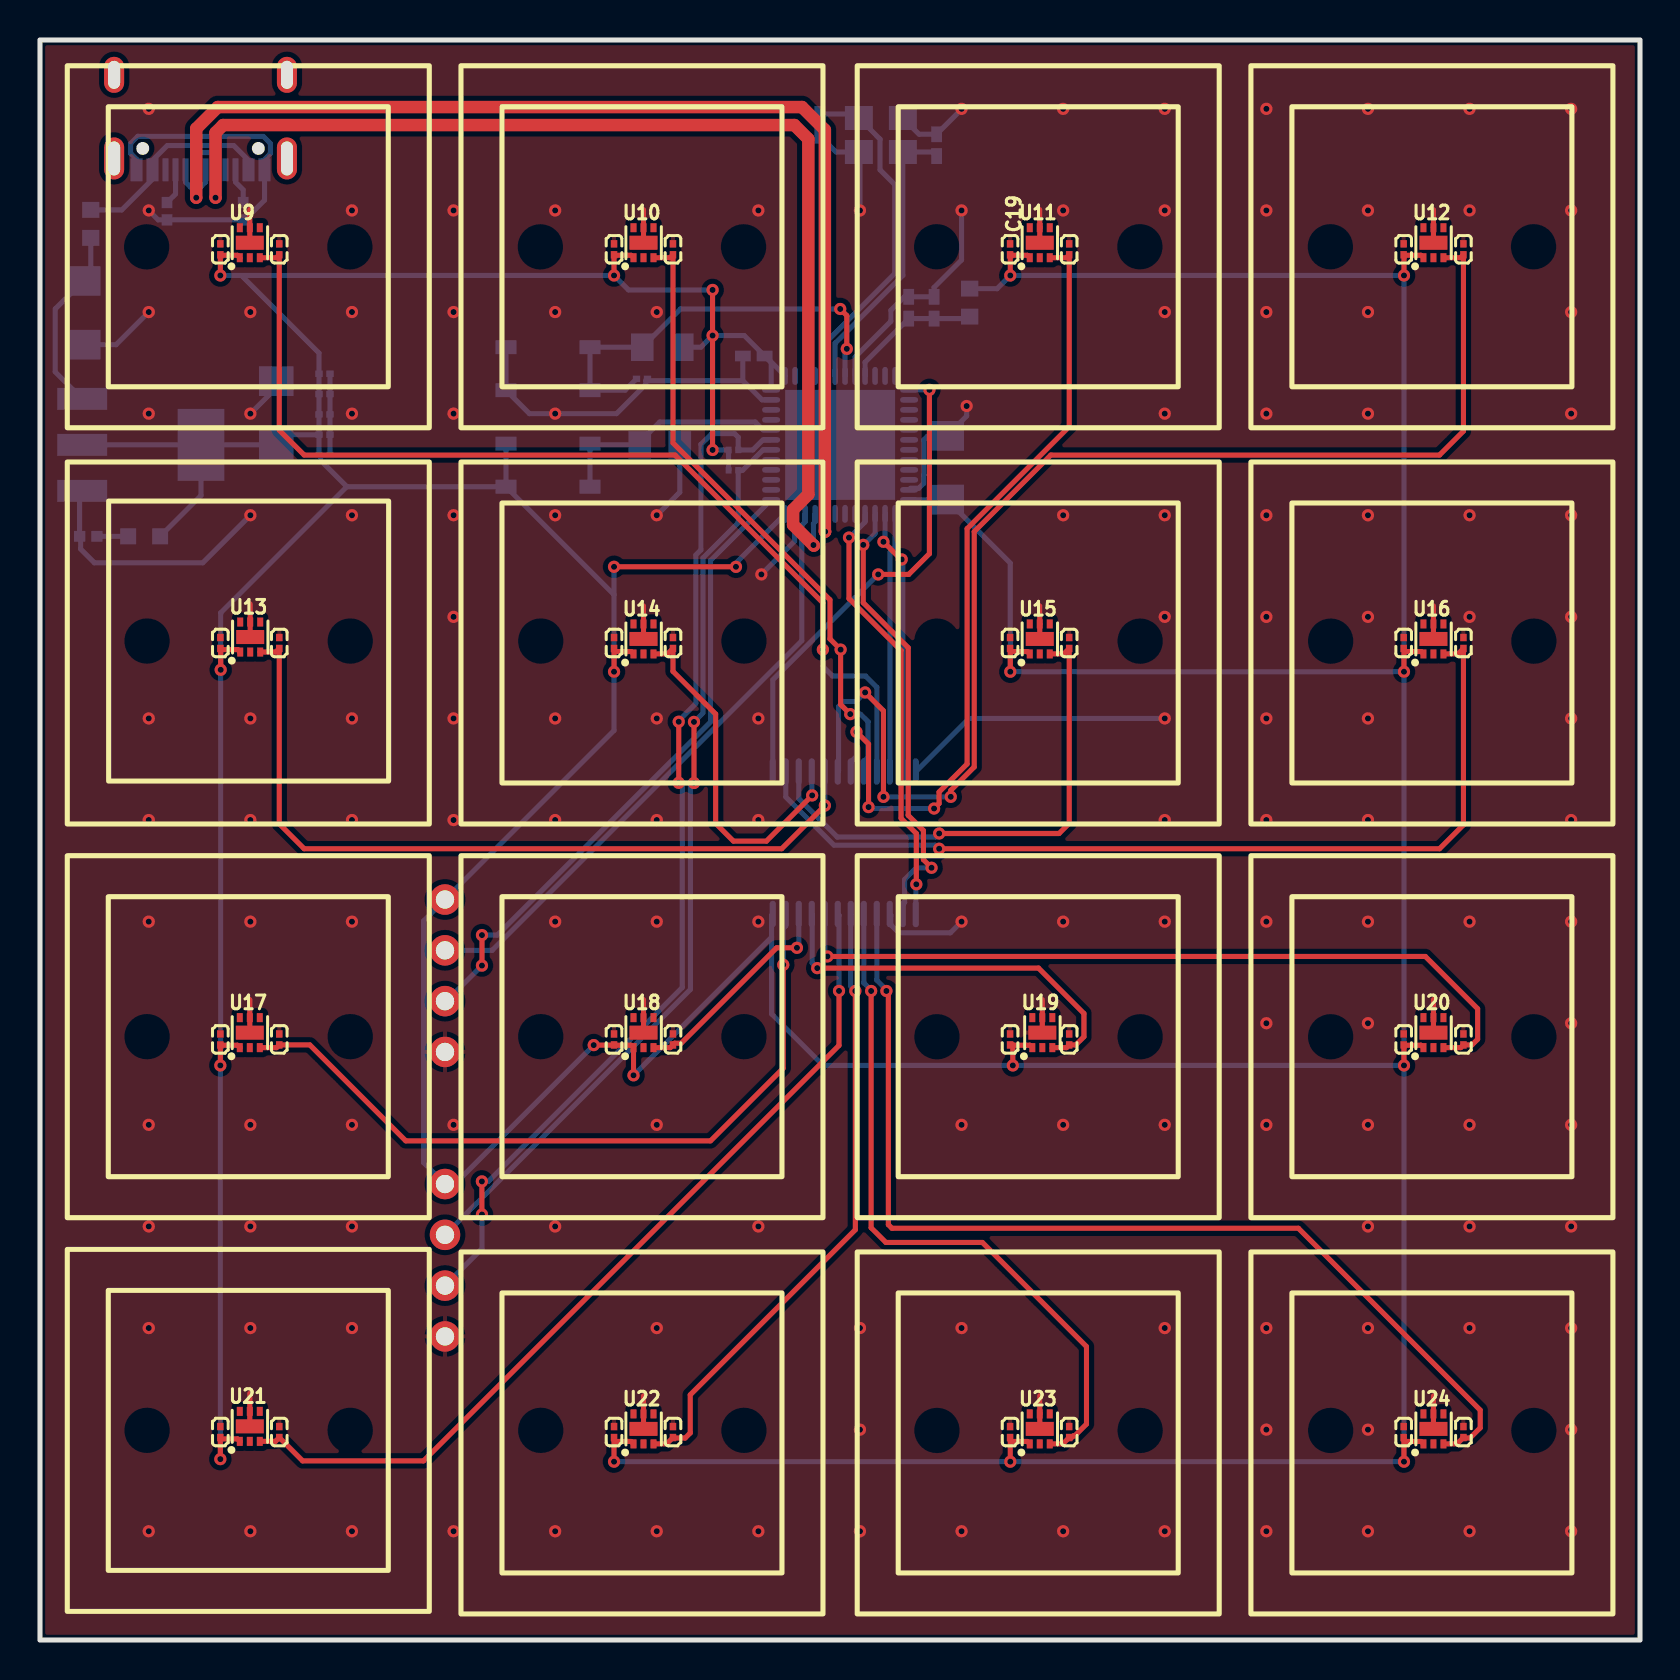
[diagram p2: board, top side]
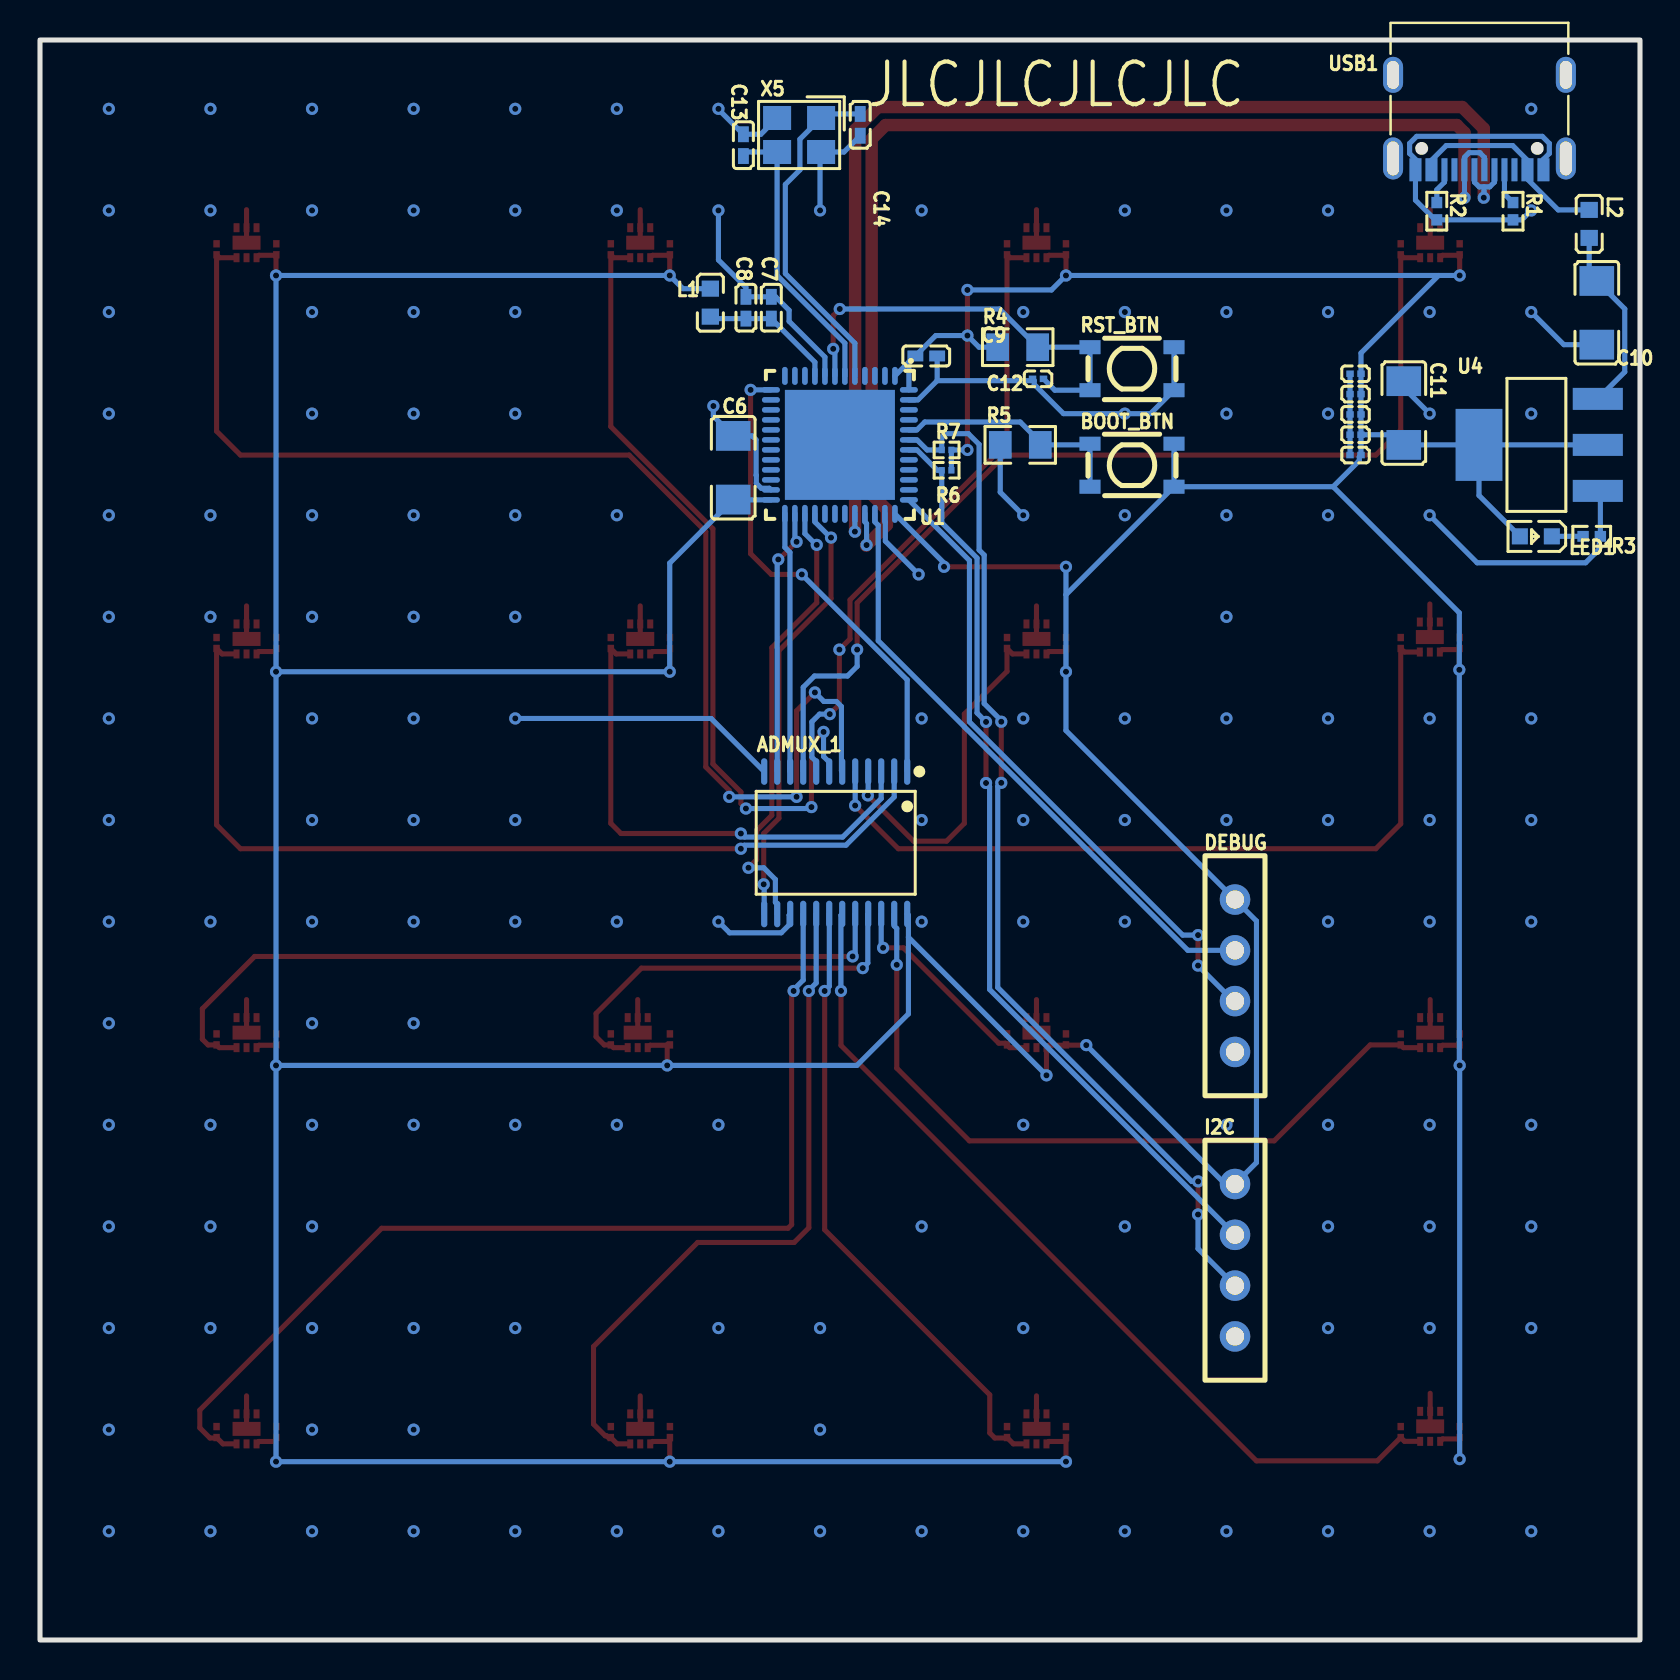
[diagram p3: board, bottom side, seen from below]

Outline 80 x 80 mm; copper layers: Top Layer, Bottom Layer. Coordinates in mm from the lower left corner of the outline.
Outline path: rectangle 0,80 80,0
Stack: Top Layer 0.035mm / Dielectric1 1.51mm FR4 er 4.5 / Bottom Layer 0.035mm

## Design rules (mm)
net USB_DN: USB_D
net USB_DP: USB_D
template: Custom Config
spacing copperThickness1oz (default): track to track 0.102, other pairs 0.152 to 0.3
spacing copperThickness2oz: track to track 0.203, other pairs 0.152 to 0.3
track width copperThickness1oz (default): min 0.127, default 0.254, max 2.54
track width copperThickness2oz: min 0.203, default 0.254, max 2.54
differential pair differentialPair (default): width min 0.438, default 0.438, max 2.54; gap min 0.203, default 0.203
via viaSize (default): diameter min 0.5, default 0.61, max 10; hole min 0.3, default 0.305, max 6.3

## Placement (name value [footprint] x y rotation side)
ADMUX_1  CD74HC4067SM96  [SSOP-24_L8.1-W5.3-P0.65-LS7.8-BL]  40.21 39.86 0 bottom
BOOT_BTN  SKRPACE010  [KEY-SMD_4P-L4.2-W3.2-P2.20-LS4.6]  25.4 58.74 0 bottom
C1  100nF  [C0201]  14.22 63.31 0 bottom
C2  100nF  [C0201]  14.22 62.3 0 bottom
C3  100nF  [C0201]  14.22 61.28 0 bottom
C4  100nF  [C0201]  14.22 60.26 0 bottom
C5  100nF  [C0201]  14.22 59.25 0 bottom
C6  10uF  [C1206]  45.34 58.61 270 bottom
C7  10nF  [C0402]  43.43 66.61 270 bottom
C8  1uF  [C0402]  44.7 66.61 270 bottom
C9  1uF  [C0402]  35.69 64.2 0 bottom
C10  22uF  [C1206]  2.16 66.36 90 bottom
C11  22uF  [C1206]  11.81 61.35 270 bottom
C12  100nF  [C0201]  30.1 63.06 0 bottom
C13  20pF  [C0402]  44.83 74.74 270 bottom
C14  20pF  [C0402]  38.99 75.76 90 bottom
C15  100nF  [C0201]  9.02 69.53 270 top
C16  100nF  [C0201]  11.96 69.53 270 top
C17  100nF  [C0201]  28.7 69.53 270 top
C18  100nF  [C0201]  31.65 69.53 270 top
C19  100nF  [C0201]  48.5 69.53 270 top
C20  100nF  [C0201]  51.46 69.53 270 top
C21  100nF  [C0201]  68.18 69.53 270 top
C22  100nF  [C0201]  71.17 69.53 270 top
C23  100nF  [C0201]  9.02 49.85 270 top
C24  100nF  [C0201]  11.96 49.85 270 top
C25  100nF  [C0201]  28.7 49.85 270 top
C26  100nF  [C0201]  31.65 49.85 270 top
C27  100nF  [C0201]  48.5 49.85 270 top
C28  100nF  [C0201]  51.46 49.85 270 top
C29  100nF  [C0201]  68.18 49.85 270 top
C30  100nF  [C0201]  71.17 49.85 270 top
C31  100nF  [C0201]  9.02 30.03 270 top
C32  100nF  [C0201]  11.96 30.03 270 top
C33  100nF  [C0201]  28.7 30.03 270 top
C34  100nF  [C0201]  31.65 30.03 270 top
C35  100nF  [C0201]  48.5 30.03 270 top
C36  100nF  [C0201]  51.46 30.03 270 top
C37  100nF  [C0201]  68.18 30.03 270 top
C38  100nF  [C0201]  71.17 30.03 270 top
C39  100nF  [C0201]  9.02 10.4 270 top
C40  100nF  [C0201]  11.96 10.4 270 top
C41  100nF  [C0201]  28.7 10.4 270 top
C42  100nF  [C0201]  31.65 10.4 270 top
C43  100nF  [C0201]  48.5 10.4 270 top
C44  100nF  [C0201]  51.46 10.4 270 top
C45  100nF  [C0201]  68.18 10.4 270 top
C46  100nF  [C0201]  71.17 10.4 270 top
DEBUG  -  [4 Pin Header]  20.25 33.21 180 bottom
I2C  -  [4 Pin Header]  20.25 18.99 180 bottom
L1  BLM18AG121SN1D  [L0603]  46.48 66.87 270 bottom
L2  BLM18AG121SN1D  [L0603]  2.54 70.81 270 bottom
LED1  KT-0603R  [LED0603-RD]  5.21 55.18 0 bottom
R1  5.1kΩ  [R0402]  6.35 71.44 90 bottom
R2  5.1kΩ  [R0402]  10.16 71.44 270 bottom
R3  5.1kΩ  [R0402]  2.41 55.18 0 bottom
R4  10kΩ  [R0805]  31.12 64.64 180 bottom
R5  10kΩ  [R0805]  30.99 59.76 0 bottom
R6  1.2kΩ  [R0201]  34.67 58.49 180 bottom
R7  1.2kΩ  [R0201]  34.67 59.5 180 bottom
RST_BTN  SKRPACE010  [KEY-SMD_4P-L4.2-W3.2-P2.20-LS4.6]  25.4 63.57 180 bottom
U1  STM32F411CEU6  [UFQFPN-48_L7.0-W7.0-P0.50-BL-EP]  40 59.76 0 bottom
U4  AMS1117-3.3  [SOT-223-3_L6.5-W3.4-P2.30-LS7.0-BR]  5.08 59.76 180 bottom
U9  HAL9303RSW  [DFN1616-6_L1.6-W1.6-P0.50-BL-EP_RICOH_RP500X]  10.49 69.86 0 top
U10  HAL9303RSW  [DFN1616-6_L1.6-W1.6-P0.50-BL-EP_RICOH_RP500X]  30.18 69.86 0 top
U11  HAL9303RSW  [DFN1616-6_L1.6-W1.6-P0.50-BL-EP_RICOH_RP500X]  49.99 69.86 0 top
U12  HAL9303RSW  [DFN1616-6_L1.6-W1.6-P0.50-BL-EP_RICOH_RP500X]  69.67 69.86 0 top
U13  HAL9303RSW  [DFN1616-6_L1.6-W1.6-P0.50-BL-EP_RICOH_RP500X]  10.51 50.15 0 top
U14  HAL9303RSW  [DFN1616-6_L1.6-W1.6-P0.50-BL-EP_RICOH_RP500X]  30.18 50.05 0 top
U15  HAL9303RSW  [DFN1616-6_L1.6-W1.6-P0.50-BL-EP_RICOH_RP500X]  49.99 50.05 0 top
U16  HAL9303RSW  [DFN1616-6_L1.6-W1.6-P0.50-BL-EP_RICOH_RP500X]  69.67 50.05 0 top
U17  HAL9303RSW  [DFN1616-6_L1.6-W1.6-P0.50-BL-EP_RICOH_RP500X]  10.49 30.37 0 top
U18  HAL9303RSW  [DFN1616-6_L1.6-W1.6-P0.50-BL-EP_RICOH_RP500X]  30.18 30.37 0 top
U19  HAL9303RSW  [DFN1616-6_L1.6-W1.6-P0.50-BL-EP_RICOH_RP500X]  50.12 30.37 0 top
U20  HAL9303RSW  [DFN1616-6_L1.6-W1.6-P0.50-BL-EP_RICOH_RP500X]  69.67 30.37 0 top
U21  HAL9303RSW  [DFN1616-6_L1.6-W1.6-P0.50-BL-EP_RICOH_RP500X]  10.49 10.68 0 top
U22  HAL9303RSW  [DFN1616-6_L1.6-W1.6-P0.50-BL-EP_RICOH_RP500X]  30.18 10.56 0 top
U23  HAL9303RSW  [DFN1616-6_L1.6-W1.6-P0.50-BL-EP_RICOH_RP500X]  49.99 10.56 0 top
U24  HAL9303RSW  [DFN1616-6_L1.6-W1.6-P0.50-BL-EP_RICOH_RP500X]  69.67 10.56 0 top
USB1  UC09-0O16F00P11  [USB-C-SMD_UC09-0O16F00P11]  8.03 75.89 0 bottom
X5  25MHz  [CRYSTAL-SMD_4P-L3.2-W2.5-BL]  42.04 75.25 0 bottom

## Footprints (pads in the part's own frame, mm; a bottom-side part is the same pattern mirrored in y, then rotated)
4 Pin Header
  round 1.524 hole 0.914: 1(0,3.81) 2(0,1.27) 3(0,-1.27) 4(0,-3.81)
C0201
  rect 0.368x0.324 smd: 1(-0.275,0) 2(0.275,0)
C0402
  rect 0.79x0.54 smd: 1(-0.545,0) 2(0.545,0)
C1206
  rect 1.485x1.728 smd: 1(-1.593,0) 2(1.593,0)
CRYSTAL-SMD_4P-L3.2-W2.5-BL
  rect 1.4x1.2 smd: 1(-1.1,-0.85) 2(1.1,-0.85) 3(1.1,0.85) 4(-1.1,0.85)
DFN1616-6_L1.6-W1.6-P0.50-BL-EP_RICOH_RP500X
  rect 0.3x0.45 smd: 1(-0.5,-0.75) 2(0,-0.75) 3(0.5,-0.75) 4(0.5,0.75) 5(0,0.75) 6(-0.5,0.75)
  rect 1.4x0.7 smd: 7(0,0)
KEY-SMD_4P-L4.2-W3.2-P2.20-LS4.6
  rect 1.05x0.7 smd: 1(-2.1,1.075) 2(2.1,1.075) 3(-2.1,-1.075) 4(2.1,-1.075)
L0603
  rect 0.8x0.864 smd: 1(-0.7,0) 2(0.7,0)
LED0603-RD
  rect 0.8x0.8 smd: 1(-0.799,0) 2(0.799,0)
R0201
  rect 0.303x0.324 smd: 1(-0.241,0) 2(0.241,0)
R0402
  rect 0.566x0.54 smd: 1(-0.433,0) 2(0.433,0)
R0805
  rect 1.133x1.377 smd: 1(-1,0) 2(1,0)
SOT-223-3_L6.5-W3.4-P2.30-LS7.0-BR
  rect 2.5x1.1 smd: 1(2.97,-2.3) 2(2.97,0) 3(2.97,2.3)
  rect 2.34x3.6 smd: 4(-2.97,0)
SSOP-24_L8.1-W5.3-P0.65-LS7.8-BL
  oval 0.308x1.324 smd: 1(-3.575,-3.562) 2(-2.925,-3.562) 3(-2.275,-3.562) 4(-1.625,-3.562) 5(-0.975,-3.562) 6(-0.325,-3.562) 7(0.325,-3.562) 8(0.975,-3.562) 9(1.625,-3.562) 10(2.275,-3.562) 11(2.925,-3.562) 12(3.575,-3.562) 13(3.575,3.562) 14(2.925,3.562) 15(2.275,3.562) 16(1.625,3.562) 17(0.975,3.562) 18(0.325,3.562) 19(-0.325,3.562) 20(-0.975,3.562) 21(-1.625,3.562) 22(-2.275,3.562) 23(-2.925,3.562) 24(-3.575,3.562)
UFQFPN-48_L7.0-W7.0-P0.50-BL-EP
  oval 0.28x0.9 smd: 1(-2.751,-3.45) 2(-2.251,-3.45) 3(-1.75,-3.45) 4(-1.25,-3.45) 5(-0.749,-3.45) 6(-0.249,-3.45) 7(0.249,-3.45) 8(0.75,-3.45) 9(1.25,-3.45) 10(1.75,-3.45) 11(2.251,-3.45) 12(2.751,-3.45) 25(2.751,3.449) 26(2.251,3.449) 27(1.75,3.449) 28(1.25,3.449) 29(0.75,3.449) 30(0.249,3.449) 31(-0.249,3.449) 32(-0.749,3.449) 33(-1.25,3.449) 34(-1.75,3.449) 35(-2.251,3.449) 36(-2.751,3.449)
  oval 0.9x0.28 smd: 13(3.45,-2.751) 14(3.45,-2.251) 15(3.45,-1.75) 16(3.45,-1.25) 17(3.45,-0.75) 18(3.45,-0.249) 19(3.45,0.249) 20(3.45,0.749) 21(3.45,1.25) 22(3.45,1.75) 23(3.45,2.251) 24(3.45,2.751) 37(-3.449,2.751) 38(-3.449,2.251) 39(-3.449,1.75) 40(-3.449,1.25) 41(-3.449,0.749) 42(-3.449,0.249) 43(-3.449,-0.249) 44(-3.449,-0.75) 45(-3.449,-1.25) 46(-3.449,-1.75) 47(-3.449,-2.251) 48(-3.449,-2.751)
  rect 5.5x5.5 smd: 49(0,0)
USB-C-SMD_UC09-0O16F00P11
  oval 1x2.1 hole 0.6x1.7: 1(-4.32,1.808) 4(4.32,1.808)
  oval 1x1.8 hole 0.6x1.4: 2(-4.32,-2.373) 3(4.32,-2.373)
  rect 0.6x1.15 smd: A1-B12(-3.2,2.373) A4-B9(-2.4,2.373) B1-A12(3.2,2.373) B4-A9(2.4,2.373)
  rect 0.3x1.15 smd: A5(-1.25,2.373) A6(-0.25,2.373) A7(0.25,2.373) A8(1.25,2.373) B5(1.75,2.373) B6(0.75,2.373) B7(-0.75,2.373) B8(-1.75,2.373)

## Nets
As in the schematic.

Pads without a net: U1 2 3 4 10 11 12 14 15 16 17 18 19 20 21 22 29 30 31 38 39 40 41 45 46 49; U9 2 4 6; U10 2 4 6; U11 2 4 6; U12 2 4 6; U13 2 4 6; U14 2 4 6; U15 2 4 6; U16 2 4 6; U17 2 4 6; U18 2 4 6; U19 2 4 6; U20 2 4 6; U21 2 4 6; U22 2 4 6; U23 2 4 6; U24 2 4 6; USB1 1 2 3 4 A8 B8

## Via types
v1: diameter 0.61, hole 0.305, Top Layer to Bottom Layer, 212 vias

## Routing (per net, layer and track width the routed paths; a pad name or vN(x,y) marks a point on that pad's centre or on a via; arc(x,y) is an arc through that point)
+3.3V: length 431.5
  Top Layer w0.254: U21.1 9.87,10.05 9.04,10.05 9.02,10.08 v1(9.02,9.04) ; U22.1 29.56,9.93 28.73,9.93 28.7,9.95 v1(28.7,8.92) ; U13.1 9.89,49.52 9.06,49.52 9.03,49.54 v1(9.03,48.51) ; v1(28.7,68.23) C17.2 28.73,69.24 29.56,69.24 U10.1 ; v1(33.63,67.5) v1(33.63,65.22) v1(33.63,59.5) ; U9.1 9.87,69.24 9.04,69.24 C15.2 v1(9.02,68.23) ; v1(27.69,29.74) 28.72,29.74 28.73,29.74 29.56,29.74 U18.1 v1(29.68,28.23) ; U24.1 69.05,9.93 68.22,9.93 68.2,9.95 v1(68.2,8.92) ; v1(48.51,8.92) 48.51,9.95 48.54,9.93 49.37,9.93 U23.1 ; v1(68.2,28.73) 68.2,29.76 68.22,29.74 69.05,29.74 U20.1 ; v1(48.64,28.73) 48.64,29.76 48.67,29.74 49.49,29.74 U19.1 ; v1(28.7,48.41) 28.7,49.45 28.73,49.42 29.56,49.42 U14.1 ; U15.1 49.37,49.42 48.54,49.42 48.51,49.45 v1(48.51,48.41) ; v1(9.02,28.73) 9.02,29.76 9.04,29.74 9.87,29.74 U17.1 ; v1(68.2,48.41) 68.2,49.45 68.22,49.42 69.05,49.42 U16.1 ; U11.1 49.37,69.24 48.54,69.24 48.51,69.26 v1(48.51,68.23) ; v1(34.8,53.66) v1(28.7,53.66) ; U12.1 69.05,69.24 68.22,69.24 68.2,69.26 v1(68.2,68.23)
  Bottom Layer w0.254: 36.58,35.14 36.58,31.31 39.16,28.73 v1(48.64,28.73) v1(68.2,28.73) ; 36.58,35.14 v1(29.68,28.23) ; 36.58,35.14 36.58,36.24 ADMUX_1.24 ; 10.07,68.23 v1(28.7,68.23) 29.42,67.5 v1(33.63,67.5) ; 10.07,68.23 v1(9.02,68.23) ; 10.07,68.23 13.95,64.35 C1.1 C2.1 C3.1 C4.1 ; L1.1 47.86,67.57 v1(48.51,68.23) v1(68.2,68.23) v1(68.2,48.41) ; C9.2 35.21,65.22 v1(33.63,65.22) 33.05,64.64 R4.1 ; C9.2 36.26,64.2 U1.1 ; C9.2 36.56,63.88 U1.48 ; v1(68.2,48.41) v1(48.51,48.41) 48.51,53.85 C6.2 45.32,57.01 U1.24 ; v1(68.2,48.41) v1(68.2,28.73) ; v1(34.8,53.66) 34.8,53.85 U1.36 ; BOOT_BTN.1 28.7,52.26 ; BOOT_BTN.1 BOOT_BTN.3 ; BOOT_BTN.1 15.34,57.67 ; 28.7,52.26 v1(28.7,53.66) ; 28.7,52.26 v1(28.7,48.41) 28.7,45.47 DEBUG.1 19.18,35.95 19.18,23.87 I2C.1 20.74,22.8 v1(27.69,29.74) ; LED1.2 8.05,57.23 U4.4 ; R6.2 R7.2 v1(33.63,59.5) ; C4.1 12.32,60.26 C11.2 U4.4 ; C4.1 C5.1 14.03,59.16 14.03,58.97 15.34,57.67 ; v1(68.2,28.73) v1(68.2,8.92) v1(48.51,8.92) v1(28.7,8.92) ; v1(9.02,9.04) v1(9.02,28.73) 9.03,28.75 v1(9.03,48.51) 9.03,51.36 15.34,57.67 ; U4.2 U4.4
+3.3VA: length 6.9
  Bottom Layer w0.254: U1.9 41.25,63.89 C7.2 44.6,66.07 ; 44.6,66.07 C8.2 46.38,66.07 ; 44.6,66.07 44.7,66.17
+5V: length 9.3
  Bottom Layer w0.254: U4.3 0.76,63.4 0.76,66.56 C10.2 2.54,68.33 L2.2
GND: length 138.2
  Top Layer w0.254: U24.7 U24.5 69.67,12.21 ; U11.7 U11.5 49.99,71.52 ; U22.7 U22.5 30.18,12.21 ; U13.7 U13.5 10.51,51.8 ; 10.49,12.34 U21.5 U21.7 ; U16.7 U16.5 69.67,51.7 ; U20.7 U20.5 69.67,32.02 ; U23.7 U23.5 49.99,12.21 ; 30.18,71.52 U10.5 U10.7 ; 30.18,51.7 U14.5 U14.7 ; 10.49,32.02 U17.5 U17.7 ; 10.49,71.52 U9.5 U9.7 ; 49.99,51.7 U15.5 U15.7 ; U18.7 U18.5 30.18,32.02 ; U12.7 U12.5 69.67,71.52 ; U19.7 U19.5 50.12,32.02
  Bottom Layer w0.254: v1(5.44,66.4) 3.81,64.77 C10.1 ; USB1.A1-B12 4.83,74.03 4.53,74.33 4.53,74.83 4.89,75.18 11.17,75.18 11.52,74.83 11.52,74.33 11.17,73.97 11.17,73.57 USB1.B1-A12 11.23,71.99 10.24,71.01 5.91,71.01 v1(5.44,71.48) ; C1.2 C2.2 C3.2 C4.2 C5.2 ; X5.2 43.96,75.29 C13.1 46.08,76.53 v1(46.08,76.56) ; v1(30.84,56.24) 31.99,57.39 R5.2 ; RST_BTN.2 RST_BTN.4 24.47,61.32 v1(25.76,61.32) 28.83,61.32 30.29,62.78 30.29,62.97 C12.2 30.46,62.97 35.14,62.97 ; 35.14,62.97 C9.1 ; 35.14,62.97 36.1,62.01 U1.47 ; v1(41,71.48) 41,74.35 X5.4 39.8,74.4 C14.1 ; v1(10.52,56.24) 8.14,53.86 2.72,53.86 2.03,54.55 2.03,55.13 R3.1 1.98,57.33 U4.1 ; v1(56.24,46.08) 46.44,46.08 ADMUX_1.12 ; U1.23 43.54,57.59 43.94,57.59 44.18,57.83 44.18,58.23 44.2,58.25 44.2,60.01 44.39,60.21 C6.1 46.33,61.2 v1(46.33,61.7) ; v1(36.07,53.28) 37.73,54.94 37.73,55.89 37.75,55.91 37.75,56.31 ; C11.1 11.81,62.61 v1(10.52,61.32) ; ADMUX_1.15 42.54,36.24 42.54,35.75 42.94,35.36 45.52,35.36 v1(46.08,35.92) ; U1.8 40.75,64.15 42.54,65.94 42.54,66.49 43.22,67.16 C7.1 C8.1 44.7,67.63 46.08,69 v1(46.08,71.48)
  vias: v1(5.44,76.56) v1(5.44,61.32) v1(5.44,46.08) v1(5.44,41) v1(5.44,35.92) v1(5.44,25.76) v1(5.44,20.68) v1(5.44,15.6) v1(5.44,5.44) v1(10.52,66.4) v1(10.52,46.08) v1(10.52,41) v1(10.52,35.92) v1(10.52,25.76) v1(10.52,20.68) v1(10.52,15.6) v1(10.52,5.44) v1(15.6,71.48) v1(15.6,66.4) v1(15.6,61.32) v1(15.6,56.24) v1(15.6,46.08) v1(15.6,41) v1(15.6,35.92) v1(15.6,25.76) v1(15.6,20.68) v1(15.6,15.6) v1(15.6,5.44) v1(20.68,71.48) v1(20.68,66.4) v1(20.68,61.32) v1(20.68,56.24) v1(20.68,51.16) v1(20.68,46.08) v1(20.68,41) v1(20.68,25.76) v1(20.68,5.44) v1(25.76,71.48) v1(25.76,66.4) v1(25.76,56.24) v1(25.76,46.08) v1(25.76,41) v1(25.76,35.92) v1(25.76,20.68) v1(25.76,5.44) v1(30.84,66.4) v1(30.84,46.08) v1(30.84,41) v1(30.84,35.92) v1(30.84,25.76) v1(30.84,15.6) v1(30.84,5.44) v1(35.92,71.48) v1(35.92,46.08) v1(35.92,41) v1(35.92,35.92) v1(35.92,20.68) v1(35.92,5.44) v1(41,15.6) v1(41,10.52) v1(41,5.44) v1(46.08,25.76) v1(46.08,15.6) v1(46.08,5.44) v1(51.16,76.56) v1(51.16,71.48) v1(51.16,56.24) v1(51.16,35.92) v1(51.16,25.76) v1(51.16,5.44) v1(56.24,76.56) v1(56.24,71.48) v1(56.24,66.4) v1(56.24,61.32) v1(56.24,56.24) v1(56.24,51.16) v1(56.24,41) v1(56.24,35.92) v1(56.24,25.76) v1(56.24,15.6) v1(56.24,5.44) v1(61.32,76.56) v1(61.32,71.48) v1(61.32,66.4) v1(61.32,61.32) v1(61.32,56.24) v1(61.32,51.16) v1(61.32,46.08) v1(61.32,41) v1(61.32,35.92) v1(61.32,30.84) v1(61.32,25.76) v1(61.32,15.6) v1(61.32,10.52) v1(61.32,5.44) v1(66.4,76.56) v1(66.4,71.48) v1(66.4,66.4) v1(66.4,61.32) v1(66.4,56.24) v1(66.4,51.16) v1(66.4,46.08) v1(66.4,41) v1(66.4,35.92) v1(66.4,30.84) v1(66.4,25.76) v1(66.4,20.68) v1(66.4,15.6) v1(66.4,10.52) v1(66.4,5.44) v1(71.48,76.56) v1(71.48,71.48) v1(71.48,56.24) v1(71.48,51.16) v1(71.48,35.92) v1(71.48,25.76) v1(71.48,20.68) v1(71.48,15.6) v1(71.48,5.44) v1(76.56,76.56) v1(76.56,71.48) v1(76.56,66.4) v1(76.56,61.32) v1(76.56,56.24) v1(76.56,51.16) v1(76.56,46.08) v1(76.56,41) v1(76.56,35.92) v1(76.56,30.84) v1(76.56,25.76) v1(76.56,20.68) v1(76.56,15.6) v1(76.56,10.52) v1(76.56,5.44)
VBUS: length 10.5
  Bottom Layer w0.254: USB1.B4-A9 10.42,73.52 10.42,73.99 9.69,74.72 6.37,74.72 5.63,73.98 USB1.A4-B9 5.63,73.04 4.09,71.5 2.54,71.5
AMUX_0: length 51.1
  Top Layer w0.254: v1(39.14,49.52) 39.14,51.86 31.75,59.25 13.21,59.25 11.96,60.49 C16.2 11.82,69.11 U9.3
  Bottom Layer w0.254: ADMUX_1.9 41.84,47.63 41.28,48.2 39.62,48.2 39.14,48.68 v1(39.14,49.52)
AMUX_1: length 31.3
  Top Layer w0.254: v1(40.51,46.29) 40.03,46.77 v1(40.03,49.52) 39.5,50.05 39.5,52.01 31.65,59.86 C18.2 31.5,69.11 U10.3
  Bottom Layer w0.254: ADMUX_1.8 41.19,43.92 41.41,44.14 41.41,45.91 41.02,46.29 v1(40.51,46.29)
AMUX_2: length 40.9
  Top Layer w0.254: v1(40.82,45.41) 41.43,44.8 v1(41.43,41.65) ; U11.3 51.31,69.11 C20.2 51.46,60.67 46.35,55.56 46.35,43.8 44.95,42.4 44.95,41.82 v1(44.7,41.57)
  Bottom Layer w0.254: v1(41.43,41.65) 41.5,41.57 v1(44.7,41.57) ; v1(40.82,45.41) 40.82,44.18 40.54,43.89 ADMUX_1.7
AMUX_3: length 64
  Top Layer w0.254: v1(45.54,42.16) 45.54,42.48 46.71,43.65 46.71,55.42 50.54,59.25 69.98,59.25 71.17,60.44 C22.2 71.02,69.11 U12.3 ; v1(42.17,42.16) 42.17,46.46 v1(41.26,47.38)
  Bottom Layer w0.254: v1(41.26,47.38) 40.81,46.93 40.18,46.93 39.93,46.67 39.93,43.46 ADMUX_1.6 ; v1(42.17,42.16) v1(45.54,42.16)
AMUX_4: length 40.2
  Top Layer w0.254: v1(39.24,41.72) 37.08,39.56 13.21,39.56 11.96,40.81 C24.2 11.79,49.4 U13.3
  Bottom Layer w0.254: ADMUX_1.5 39.24,41.73 v1(39.24,41.72)
AMUX_5: length 18.1
  Top Layer w0.254: U14.3 31.38,49.3 C26.2 31.65,48.43 33.78,46.3 33.78,40.83 34.67,39.94 36.32,39.94 v1(38.61,42.23)
  Bottom Layer w0.254: v1(38.61,42.23) 38.59,42.25 ADMUX_1.4
AMUX_6: length 25.8
  Top Layer w0.254: v1(44.96,40.33) 50.95,40.33 51.46,40.83 C28.2 51.19,49.3 U15.3
  Bottom Layer w0.254: ADMUX_1.3 37.94,42.07 39.87,40.15 44.78,40.15 v1(44.96,40.33)
AMUX_7: length 46.7
  Top Layer w0.254: v1(44.96,39.56) 69.98,39.56 71.17,40.76 C30.2 70.9,49.3 U16.3
  Bottom Layer w0.254: v1(44.96,39.56) 44.78,39.74 39.7,39.74 37.29,42.15 ADMUX_1.2
AMUX_8: length 37.5
  Top Layer w0.254: v1(37.16,33.76) 37.16,28.59 33.53,24.96 18.29,24.96 13.49,29.75 C32.2 11.83,29.62 U17.3
  Bottom Layer w0.254: ADMUX_1.23 37.29,35.7 37.16,35.58 v1(37.16,33.76)
AMUX_9: length 11
  Top Layer w0.254: U18.3 31.51,29.62 C34.2 31.73,29.84 32.06,29.84 36.83,34.61 v1(37.85,34.61)
  Bottom Layer w0.254: v1(37.85,34.61) 37.94,34.7 ADMUX_1.22
AMUX_10: length 20.1
  Top Layer w0.254: v1(38.86,33.59) 49.93,33.59 52.2,31.33 52.2,30.17 51.79,29.75 C36.2 51.32,29.62 U19.3
  Bottom Layer w0.254: ADMUX_1.21 38.61,36.28 38.61,33.85 v1(38.86,33.59)
AMUX_11: length 39.2
  Top Layer w0.254: U20.3 71.03,29.62 C38.2 71.6,29.75 71.88,30.04 71.88,31.56 69.27,34.18 v1(39.37,34.18)
  Bottom Layer w0.254: v1(39.37,34.18) 39.24,34.31 ADMUX_1.20
AMUX_12: length 44.7
  Top Layer w0.254: U21.3 11.77,9.93 C40.2 13.13,8.96 19.18,8.96 39.95,29.73 v1(39.95,32.45)
  Bottom Layer w0.254: ADMUX_1.19 39.95,36.24 39.95,32.46 v1(39.95,32.45)
AMUX_13: length 31.5
  Top Layer w0.254: v1(40.77,32.45) 40.77,20.51 32.51,12.26 32.51,10.35 32.26,10.1 31.67,10.1 C42.2 31.33,9.81 U22.3
  Bottom Layer w0.254: ADMUX_1.18 40.53,36.29 40.53,32.68 v1(40.77,32.45)
AMUX_14: length 35.1
  Top Layer w0.254: v1(41.56,32.45) 41.56,20.61 42.29,19.88 47.12,19.88 52.32,14.67 52.32,10.79 51.74,10.21 51.67,10.21 51.56,10.1 ; C44.2 51.14,9.81 U23.3
  Bottom Layer w0.254: v1(41.56,32.45) 41.56,32.49 41.19,32.85 ADMUX_1.17
AMUX_15: length 52.3
  Top Layer w0.254: U24.3 70.85,9.81 C46.2 71.19,10.1 71.5,10.1 72.01,10.61 72.01,11.5 62.92,20.59 42.6,20.59 42.42,20.77 42.42,32.35 v1(42.32,32.45)
  Bottom Layer w0.254: v1(42.32,32.45) 42.32,32.52 41.84,32.99 ADMUX_1.16
AMUX_COM: length 24.2
  Top Layer w0.254: v1(41.91,53.28) 43.43,53.28 44.47,54.32 v1(44.47,62.51)
  Bottom Layer w0.254: v1(41.91,53.28) 36.64,48.01 ADMUX_1.1 ; v1(44.47,62.51) U1.13
BOOT0: length 12
  Bottom Layer w0.254: BOOT_BTN.2 BOOT_BTN.4 27.56,59.76 R5.1 29.99,59.9 30.99,60.9 35.76,60.9 36.15,60.51 U1.44
HSE_IN: length 17.1
  Bottom Layer w0.254: U1.5 39.26,64.84 42.73,68.32 42.73,72.78 42,73.5 42,75.04 X5.1 40.74,76.3 C14.2
HSE_OUT: length 14.4
  Bottom Layer w0.254: C13.2 44.63,74.4 X5.3 43.15,68.23 39.76,64.84 U1.6
NRST: length 21.5
  Top Layer w0.254: v1(40.01,66.55) 40.34,66.22 v1(40.34,64.56)
  Bottom Layer w0.254: U1.7 40.25,64.47 v1(40.34,64.56) ; v1(40.01,66.55) 32.03,66.55 R4.2 RST_BTN.1 RST_BTN.3 29.26,62.49 C12.1
SCL: length 46.4
  Top Layer w0.254: v1(32.7,42.85) v1(32.7,45.9)
  Bottom Layer w0.254: 20.25,20.26 32.52,32.53 32.52,42.67 v1(32.7,42.85) ; v1(32.7,45.9) 33.15,46.35 33.15,54.1 34.91,55.87 R6.1 35.13,58.49 36.15,59.51 U1.42
SDA: length 52.4
  Top Layer w0.254: v1(22.09,22.93) 22.09,21.28 v1(22.1,21.28) ; v1(31.94,45.91) v1(31.94,42.86)
  Bottom Layer w0.254: U1.43 36.15,60 35.65,59.5 R7.1 34.91,60.14 34.73,60.32 33.58,60.32 33.04,59.78 33.04,54.5 32.79,54.25 32.79,46.82 31.94,45.97 v1(31.94,45.91) ; v1(31.94,42.86) 32.11,42.68 32.11,32.63 22.42,22.93 v1(22.09,22.93) ; I2C.3 22.1,19.57 v1(22.1,21.28)
SEL0: length 13
  Bottom Layer w0.254: ADMUX_1.10 42.5,43.44 42.5,54.38 42.76,54.63 U1.25
SEL1: length 13.3
  Top Layer w0.254: v1(42.17,54.91) 43.05,54.03 v1(43.09,54.03)
  Bottom Layer w0.254: v1(43.09,54.03) 43.14,53.97 ADMUX_1.11 ; v1(42.17,54.91) 42.26,54.99 U1.26
SEL2: length 22.7
  Top Layer w0.254: v1(44.58,38.61) 44.17,39.02 44.17,40.47 43.41,41.23 43.41,49.62 41.16,51.86 v1(41.16,54.76)
  Bottom Layer w0.254: v1(44.58,38.61) 43.81,38.61 43.23,38.03 43.23,36.88 43.14,36.79 ADMUX_1.14 ; v1(41.16,54.76) 41.19,54.76 41.76,55.32 U1.27
SEL3: length 21.8
  Top Layer w0.254: v1(40.45,55.12) 40.45,52.07 43.05,49.47 43.05,41.09 43.81,40.33 v1(43.81,37.78)
  Bottom Layer w0.254: ADMUX_1.13 43.79,37.76 v1(43.81,37.78) ; U1.28 41.25,55.9 40.47,55.12 v1(40.45,55.12)
SWCLK: length 32.3
  Top Layer w0.254: v1(22.1,35.25) v1(22.1,33.72)
  Bottom Layer w0.254: v1(22.1,33.72) 20.32,31.94 DEBUG.3 ; v1(22.1,35.25) 22.86,35.25 33.53,45.91 33.53,53.98 U1.37
SWDIO: length 30.7
  Bottom Layer w0.254: U1.34 38.25,55.9 38.09,55.74 38.09,49.97 22.61,34.48 20.25,34.48
USB_DN: length 59.7
  Top Layer w0.622: v1(39.26,55.42) 39.24,55.43 39.24,75.5 38.1,76.65 8.89,76.65 7.81,75.57 v1(7.81,72.12)
  Bottom Layer w0.254: v1(39.26,55.42) U1.32 ; v1(7.81,72.12) 7.8,72.13 7.8,72.66 ; USB1.A7 8.28,72.89 8.04,72.66 7.8,72.66 ; 7.28,73.47 7.28,72.89 7.51,72.66 7.8,72.66
USB_DP: length 59.8
  Top Layer w0.622: 38.7,54.72 38.69,54.72 37.66,55.76 37.66,56.52 38.42,57.28 38.42,75.05 37.72,75.75 9.16,75.75 8.78,75.37 v1(8.78,72.12)
  Bottom Layer w0.254: 7.78,74.13 7.78,73.54 ; 38.63,54.75 38.67,54.79 38.67,55.82 38.76,55.9 U1.33 ; v1(8.78,72.12) USB1.B6 8.78,74.13 8.54,74.37 8.01,74.37 7.78,74.13
  vias: v1(38.67,54.75)
$1N3487: length 1.8
  Bottom Layer w0.254: R1.2 6.78,72.3 USB1.A5
$1N3526: length 1.8
  Bottom Layer w0.254: USB1.B5 9.78,72.89 10.16,72.51 R2.1
$1N4144: length 1.6
  Bottom Layer w0.254: LED1.1 R3.2

## Copper pours and planes (outline as drawn; the poured copper is in the pictures)
+3.3V on Bottom Layer: 0,80 80,80 80,0 0,0
GND on Top Layer: 0,80 80,80 80,0 0,0

## Text on the board
Bottom Silkscreen Layer: JLCJLCJLCJLC
